# Altium project BiSheFinal.PrjPcb
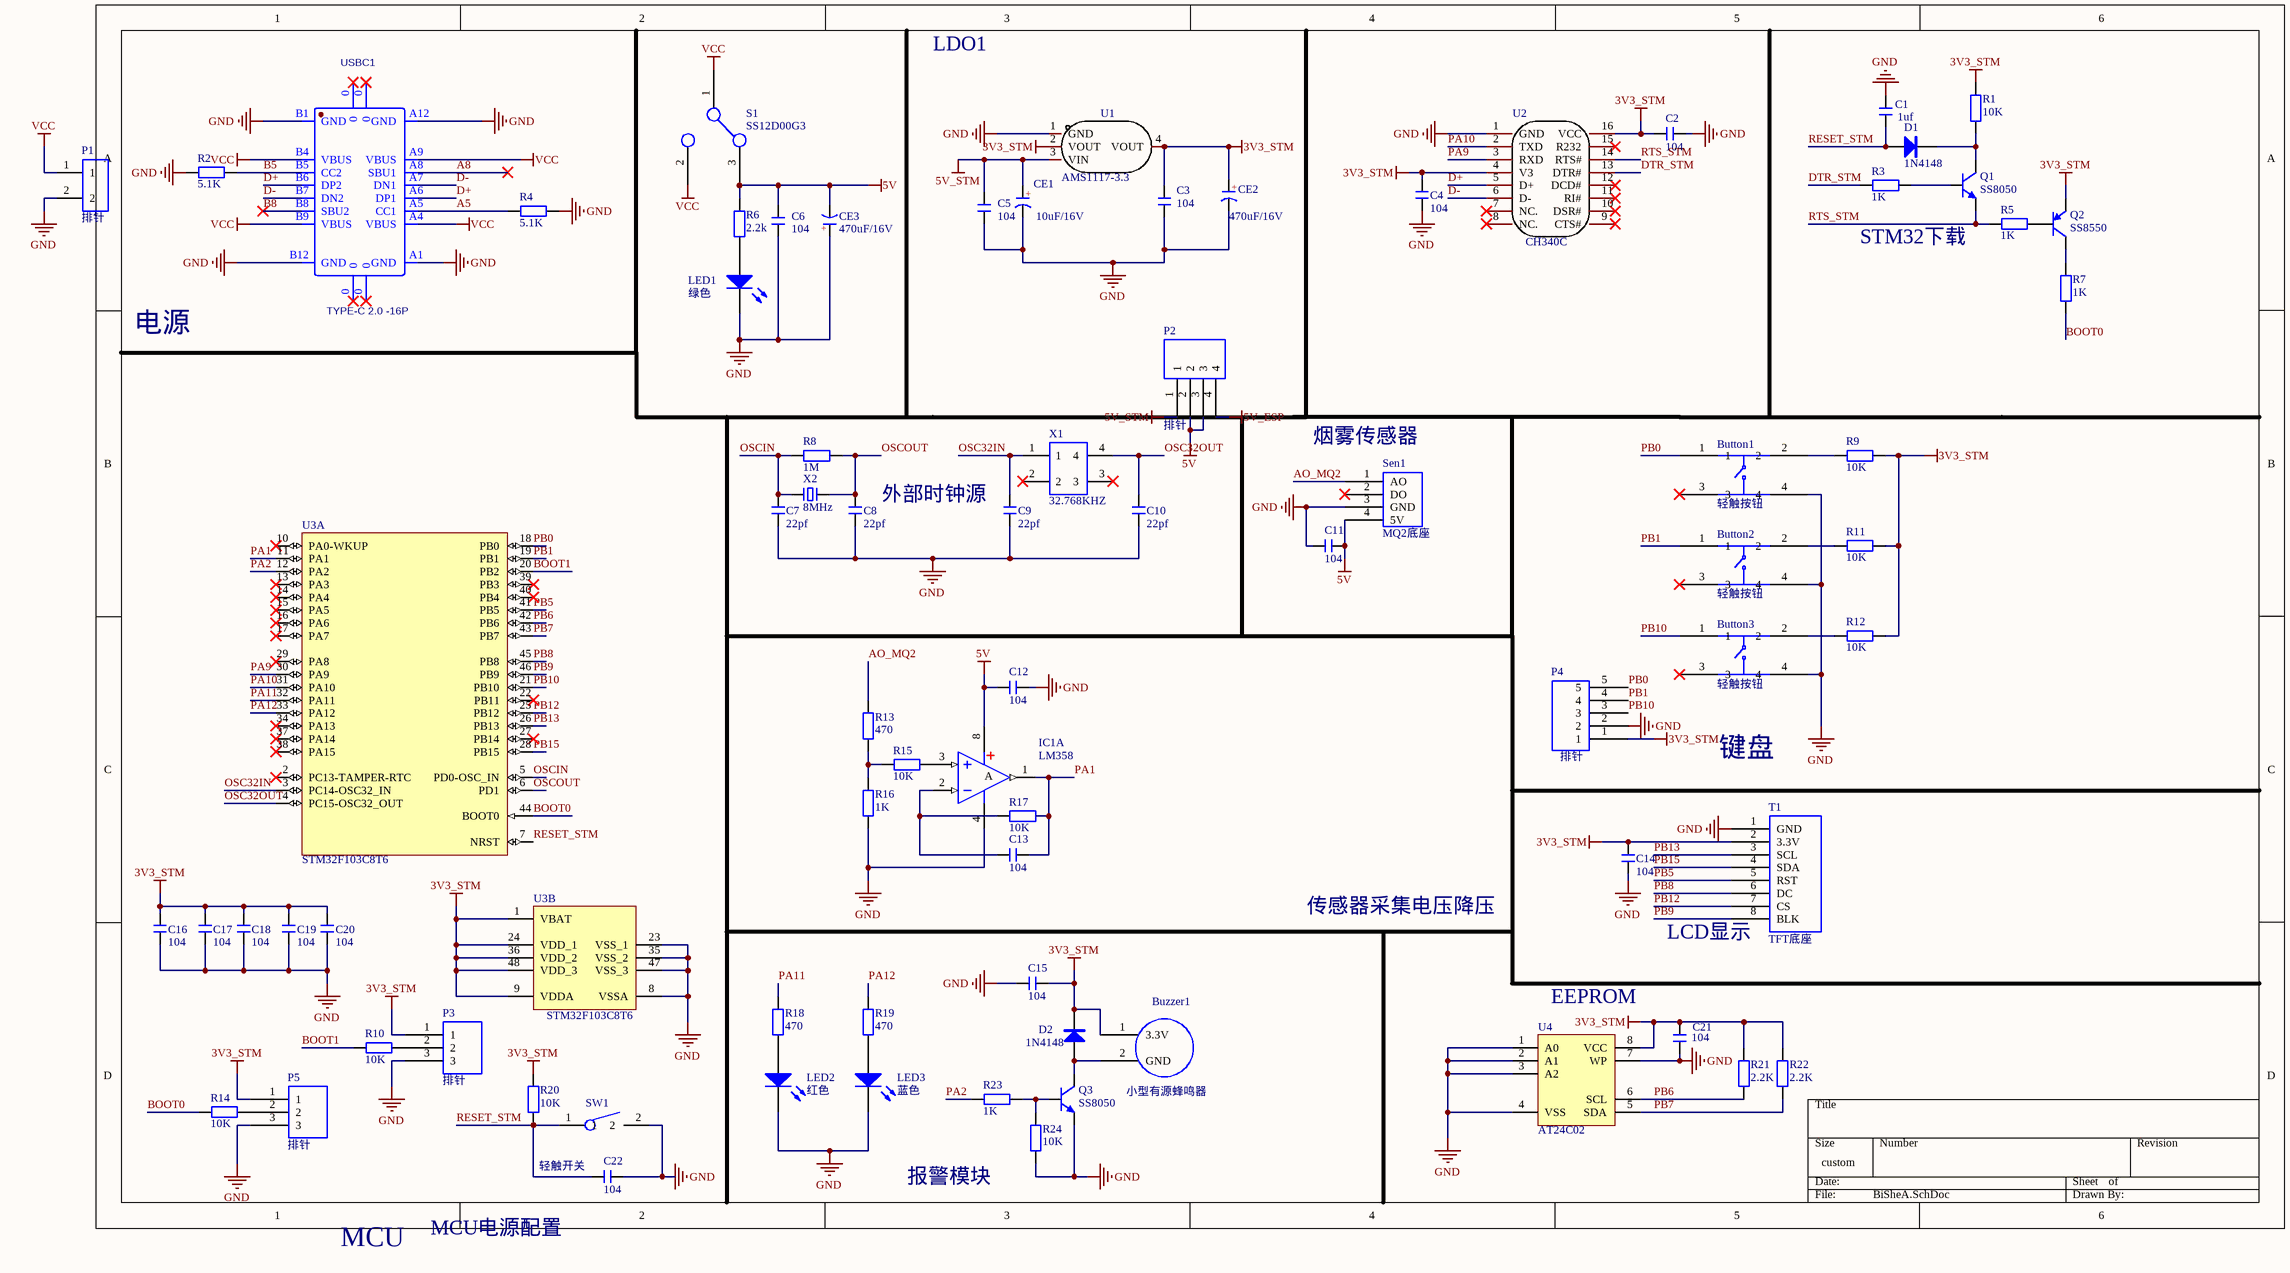
[diagram p0: BiSheA.SchDoc]
2 sheets, 102 parts. Net scope: global (net labels, ports and power ports of the same name join across sheets).
Board file: BiShe.PcbDoc
Sheets:
  BiSheA.SchDoc
  BiSheB.SchDoc

## Sheet BiSheA.SchDoc
size 431 x 241 mm; SheetNumber: 1; SheetTotal: 2

### Parts
Button1  轻触按钮  [Button]
Button2  轻触按钮  [Button]
Button3  轻触按钮  [Button]
Buzzer1  小型有源蜂鸣器  [Buzzer_Mini]
C1  1uf  [C 0805_L]
C2  104  [C 0805_L]
C3  104  [C 0805_L]
C4  104  [C 0805_L]
C5  104  [C 0805_L]
C6  104  [C 0805_L]
C7  22pf  [C 0805_L]
C8  22pf  [C 0805_L]
C9  22pf  [C 0805_L]
C10  22pf  [C 0805_L]
C11  104  [C 0805_L]
C12  104  [C 0805_L]
C13  104  [C 0805_L]
C14  104  [C 0805_L]
C15  104  [C 0805_L]
C16  104  [C 0805_L]
C17  104  [C 0805_L]
C18  104  [C 0805_L]
C19  104  [C 0805_L]
C20  104  [C 0805_L]
C21  104  [C 0805_L]
C22  104  [C 0805_L]
CE1  10uF/16V  [CAP 1.5*4*8]
CE2  470uF/16V  [CAP 3.5*8*11.5]
CE3  470uF/16V  [CAP 3.5*8*11.5]
D1  1N4148  [SOD-123]
D2  1N4148  [SOD-123]
IC1  LM358  [SOP8_N]  (part A of 2)
LED1  绿色  [LED 5MM-B]
LED2  红色  [LED 5MM-B]
LED3  蓝色  [LED 5MM-B]
P1  排针  [2PIN]
P2  排针  [4PIN]
P3  排针  [3Pin]
P4  排针  [5pin]
P5  排针  [3Pin]
Q1  SS8050  [SOT23-3N]
Q2  SS8550  [SOT23-3N]
Q3  SS8050  [SOT23-3N]
R1  10K  [R 0805_L]
R2  5.1K  [R 0805_L]
R3  1K  [R 0805_L]
R4  5.1K  [R 0805_L]
R5  1K  [R 0805_L]
R6  2.2k  [R 0805_L]
R7  1K  [R 0805_L]
R8  1M  [R 0805_L]
R9  10K  [R 0805_L]
R10  10K  [R 0805_L]
R11  10K  [R 0805_L]
R12  10K  [R 0805_L]
R13  470  [R 0805_L]
R14  10K  [R 0805_L]
R15  10K  [R 0805_L]
R16  1K  [R 0805_L]
R17  10K  [R 0805_L]
R18  470  [R 0805_L]
R19  470  [R 0805_L]
R20  10K  [R 0805_L]
R21  2.2K  [R 0805_L]
R22  2.2K  [R 0805_L]
R23  1K  [R 0805_L]
R24  10K  [R 0805_L]
S1  SS12D00G3  [SS12D00G3]
Sen1  MQ2底座  [MQ2底座]
SW1  轻触开关  [SW1P]
T1  TFT底座  [TFT底座]
U1  AMS1117-3.3  [SOT-223-3_L6.5-W3.4-P2.30-LS7.0-BR]
U2  CH340C  [SOP-16_L10.0-W3.9-P1.27-LS6.0-BL]
U3  STM32F103C8T6  [LQFP48_N]  (parts A,B of 2)
U4  AT24C02  [SOIC8_N]
USBC1  TYPE-C 2.0 -16P  [USB-C-SMD_TYPE-C-USB-5]
X1  32.768KHZ  [MC-306]
X2  8MHz  [OSC HC-49S]

### Nets
3V3_STM: Buzzer1.1(3.3V) C2.1 C3.2 C4.2 C14.2 C15.2 C16.1 C17.1 C18.1 C19.1 C20.1 C21.2 CE2.1(A) D2.2(K) P3.1 P4.1 P5.1 Q2.2(E) R1.1 R9.1 R11.1 R12.1 R20.1 R21.1 R22.1 T1.2(3.3V) U1.2(VOUT) U1.4(VOUT) U2.4(V3) U2.16(VCC) U3.1(VBAT) U3.9(VDDA) U3.24(VDD_1) U3.36(VDD_2) U3.48(VDD_3) U4.8(VCC)
5V: C6.2 C11.2 C12.2 CE3.2(K) IC1.8(V+) P2.2 P2.3 R6.1 S1.3 Sen1.4(5V)
5V_ESP: P2.4
5V_STM: C5.2 CE1.1(A) P2.1 U1.3(VIN)
GND: Button1.4 Button2.4 Button3.4 C1.1 C2.2 C3.1 C4.1 C5.1 C6.1 C7.2 C8.2 C9.2 C10.2 C11.1 C12.1 C14.1 C15.1 C16.2 C17.2 C18.2 C19.2 C20.2 C21.1 C22.2 CE1.2(K) CE2.2(K) CE3.1(A) IC1.4(V-) LED1.2(K) LED2.2(K) LED3.2(K) P1.2 P3.3 P4.2 P5.3 Q3.2(E) R2.2 R4.1 R16.2 R24.2 Sen1.3(GND) SW1.2 T1.1(GND) U1.1(GND) U2.1(GND) U3.8(VSSA) U3.23(VSS_1) U3.35(VSS_2) U3.47(VSS_3) U4.1(A0) U4.2(A1) U4.3(A2) U4.4(VSS) U4.7(WP) USBC1.A1(GND) USBC1.A12(GND) USBC1.B1(GND) USBC1.B12(GND)
VCC: P1.1 S1.1 S1.2 USBC1.A4(VBUS) USBC1.A9(VBUS) USBC1.B4(VBUS) USBC1.B9(VBUS)
A5: R4.2 USBC1.A5(CC1)
A8: USBC1.A8(SBU1)
AO_MQ2: R13.1 Sen1.1(AO)
B5: R2.1 USBC1.B5(CC2)
B8: USBC1.B8(SBU2)
BOOT0: R7.2 R14.2 U3.44(BOOT0)
BOOT1: R10.2 U3.20(PB2)
D+: U2.5(D+) USBC1.A6(DP1) USBC1.B6(DP2)
D-: U2.6(D-) USBC1.A7(DN1) USBC1.B7(DN2)
DTR_STM: R3.1 U2.13(DTR#)
OSC32IN: C9.1 U3.3(PC14-OSC32_IN) X1.1
OSC32OUT: C10.1 U3.4(PC15-OSC32_OUT) X1.4
OSCIN: C7.1 R8.2 U3.5(PD0-OSC_IN) X2.1
OSCOUT: C8.1 R8.1 U3.6(PD1) X2.2
PA1: C13.1 IC1.1(OUT) R17.1 U3.11(PA1)
PA2: R23.1 U3.12(PA2)
PA9: U2.3(RXD) U3.30(PA9)
PA10: U2.2(TXD) U3.31(PA10)
PA11: R18.1 U3.32(PA11)
PA12: R19.1 U3.33(PA12)
PB0: Button1.1 P4.5 U3.18(PB0)
PB1: Button2.1 P4.4 U3.19(PB1)
PB5: T1.5(RST) U3.41(PB5)
PB6: R21.2 U3.42(PB6) U4.6(SCL)
PB7: R22.2 U3.43(PB7) U4.5(SDA)
PB8: T1.6(DC) U3.45(PB8)
PB9: T1.8(BLK) U3.46(PB9)
PB10: Button3.1 P4.3 U3.21(PB10)
PB12: T1.7(CS) U3.25(PB12)
PB13: T1.3(SCL) U3.26(PB13)
PB15: T1.4(SDA) U3.28(PB15)
RESET_STM: C1.2 C22.1 D1.1(A) R20.2 SW1.1 U3.7(NRST)
RTS_STM: Q1.2(E) R5.1 U2.14(RTS#)
NetButton1_2: Button1.2 R9.2
NetButton2_2: Button2.2 R11.2
NetButton3_2: Button3.2 R12.2
NetBuzzer1_2: Buzzer1.2(GND) D2.1(A) Q3.3(C)
NetC13_2: C13.2 IC1.2(IN-) R17.2
NetD1_2: D1.2(K) Q1.3(C) R1.2
NetIC1_3: IC1.3(IN+) R15.1
NetLED1_1: LED1.1(A) R6.2
NetLED2_1: LED2.1(A) R18.2
NetLED3_1: LED3.1(A) R19.2
NetP3_2: P3.2 R10.1
NetP5_2: P5.2 R14.1
NetQ1_1: Q1.1(B) R3.2
NetQ2_1: Q2.1(B) R5.2
NetQ2_3: Q2.3(C) R7.1
NetQ3_1: Q3.1(B) R23.2 R24.1
NetR13_2: R13.2 R15.2 R16.1

Not connected (* = marked no-connect by the designer): Button1 3*; Button2 3*; Button3 3*; Sen1 2(DO)*; U2 7(NC.)* 8(NC.)* 9(CTS#)* 10(DSR#)* 11(RI#)* 12(DCD#)* 15(R232)*; U3 2(PC13-TAMPER-RTC)* 10(PA0-WKUP)* 13(PA3)* 14(PA4)* 15(PA5)* 16(PA6)* 17(PA7)* 22(PB11)* 27(PB14)* 29(PA8)* 34(PA13)* 37(PA14)* 38(PA15)* 39(PB3)* 40(PB4)*; USBC1 0*; X1 2* 3*

### Notes on the sheet
- LDO1
- STM32下载
- 电源
- (near Sen1) 烟雾传感器
- (near C8) 外部时钟源
- 键盘
- 传感器采集电压降压
- LCD显示
- (near U4) EEPROM
- 报警模块
- MCU
- MCU电源配置
- (in symbol CE) +
- (in symbol LM358, part A) A

### Library data of the parts
Button1-Button3 = Button: 6*6*7轻触按钮
Buzzer1 = Buzzer: 蜂鸣器
C1-C22 = C: 贴片电容; BOM名称: 无极性贴片电容; 淘宝ID: 封装库来自淘宝 ID：黄晶宝石; 联系售后，技术支持: https://shop463601444.taobao.com; 唯一出售店铺网址: https://shop463601444.taobao.com
CE1-CE3 = CE: 直插电解电容; 淘宝ID: 封装库来自淘宝 ID：黄晶宝石; BOM名称: 直插电解电容; 联系售后: https://item.taobao.com/item.htm?id=566775463719
D1 D2 = 1N4148: 开关二极管; BOM名称: 高速开关二极管; 淘宝ID: 封装库来自淘宝 ID：黄晶宝石
IC1 = LM358: 双路运放; 学习资源: 最新版本发布https://item.taobao.com/item.htm?id=566775463719; BOM名称: 双路运放
LED1-LED3 = LED-5MM: 直插5mm LED; BOM名称: 5mm插件LED; 版权归属: 封装库来自淘宝 ID：黄晶宝石; 学习资源: https://item.taobao.com/item.htm?id=566775463719
P1 = 2Pin: 2Pin排针
P2 = 4Pin: 4p排针
P3 P5 = 3Pin: 3p排针
P4 = 5Pin: 5Pin排针
Q1 Q3 = 8050-SMD: 高频放大-NPN型; 联系售后: 最新版本发布https://item.taobao.com/item.htm?id=566775463719; 版权归属: 封装库来自淘宝 ID：黄晶宝石; 属性: 40V 1.5A 1W 100MHZ; BOM名称: 高频放大-NPN型
Q2 = 8550-SMD: 高频放大-PNP型; 学习资源: 最新版本发布https://item.taobao.com/item.htm?id=566775463719; 版权归属: 封装库来自淘宝 ID：黄晶宝石; 属性: 40V 1.5A 1W 100MHZ; BOM名称: 高频放大-PNP型
R1-R24 = R: 贴片电阻; 版权归属: 来自淘宝 ID：黄晶宝石; 封装库来自淘宝卖家 ID：黄晶宝石: 其他店铺购入均为盗版，不享受售后技术支持服务，请立即申请退款; BOM名称: 贴片电阻; 联系售后: https://item.taobao.com/item.htm?id=566775463719
S1 = SS12D00G3: 拨动开关
Sen1 = MQ2底座: 气体传感器
SW1 = SW1P: 单刀单掷清除开关
T1 = TFT底座: 底座
U1 = AMS1117-3.3_C6186: 输出类型:固定;输出极性:正;最大输入电压:-;输出电压:3.3V;输出电流:1A;电源纹波抑制比(PSRR):72dB@(120Hz);; Manufacturer: AMS; Add into BOM: yes; Output Type: 固定; Output Polarity: 正; Number of Outputs: 1; Output Voltage: 3.3V; Dropout Voltage: 1.3V@(800mA); Output Current: 1A; Symbol: AMS1117-3.3; Device: AMS1117-3.3_C6186; LCSC Part Name: 正 Vout=3.3V 1A 72dB@(120Hz); Supplier Part: C6186; Manufacturer Part: AMS1117-3.3; Supplier Footprint: SOT-223; JLCPCB Part Class: Basic Part; Datasheet: https://atta.szlcsc.com/upload/public/pdf/source/20180727/C6186_7A095716F0823C02F1997A905E26C086.pdf; Supplier: LCSC; Convert to PCB: yes; Maximum Input Voltage: -; Quiescent Current (Ground Current): -; Power Supply Rejection Ratio (PSRR): 72dB@(120Hz); Noise: -; Feature: -; Operating Temperature: -; AMS1117: AMS1117-3.3
U2 = CH340C: 驱动器/接收器数:-;协议类别:USB 2.0;类型:Transceiver;数据速率:2Mbps;; Manufacturer: WCH(南京沁恒); Add into BOM: yes; Protocol: USB 2.0; Supply Voltage: 3.3V, 5V; Data Rate: 2Mbps; Symbol: CH340C; Device: CH340C; LCSC Part Name: CH340C; Supplier Part: C84681; Manufacturer Part: CH340C; Supplier Footprint: SOP-16_150mil; JLCPCB Part Class: Extended Part; Datasheet: https://atta.szlcsc.com/upload/public/pdf/source/20200819/C84681_ADBED554CE321879DBD6B1D06488689C.pdf; Supplier: LCSC; Convert to PCB: yes; Number of Drivers/Receivers: -; Type: Transceiver; CH340C: CH340C
U3 = STM32F103C8T6: STM32 ARM-based 32-bit MCU Performance Line with 64 kB Flash, 20 kB Internal RAM, -40 to +85癈 Temperature, 48-Pin LQFP, Tray; DatasheetVersion: rev13.0, Apr-2011; PackageVersion: rev13, Apr-2011; PackageReference: LQFP48; PackageDescription: 48-Pin Low-Profile Quad Flat Pack, 7 x 7 mm Body, 0.5 mm Pitch (LQFP48); ComponentLink1Description: Manufacturer URL; ComponentLink1URL: http://www.st.com/; ComponentLink2Description: STM32F103 Datasheet; ComponentLink2URL: http://www.st.com/internet/com/TECHNICAL_RESOURCES/TECHNICAL_LITERATURE/DATASHEET/CD00161566.pdf; ComponentLink3Description: STM32 Family Web Page; ComponentLink3URL: www.st.com/stm32; 联系售后: https://shop463601444.taobao.com
U4 = AT24C02: EEROM存储器
USBC1 = USB2.0 Type-C 16Pin母座: USB2.0 Type-C 母座 16Pin; BOM_Supplier: LCSC; BOM_Manufacturer Part: -; spiceSymbolName: TYPE-C 3.1 -16P_C168689
X1 = MC-306: 贴片32.768KHZ
X2 = XTAL-2P: 2脚无源脚晶振; 版权归属: 封装库来自淘宝卖家 ID：黄晶宝石; BOM名称: 2脚无源脚晶振; 学习资源: https://shop463601444.taobao.com

## Sheet BiSheB.SchDoc
size A4; SheetNumber: 2; SheetTotal: 2
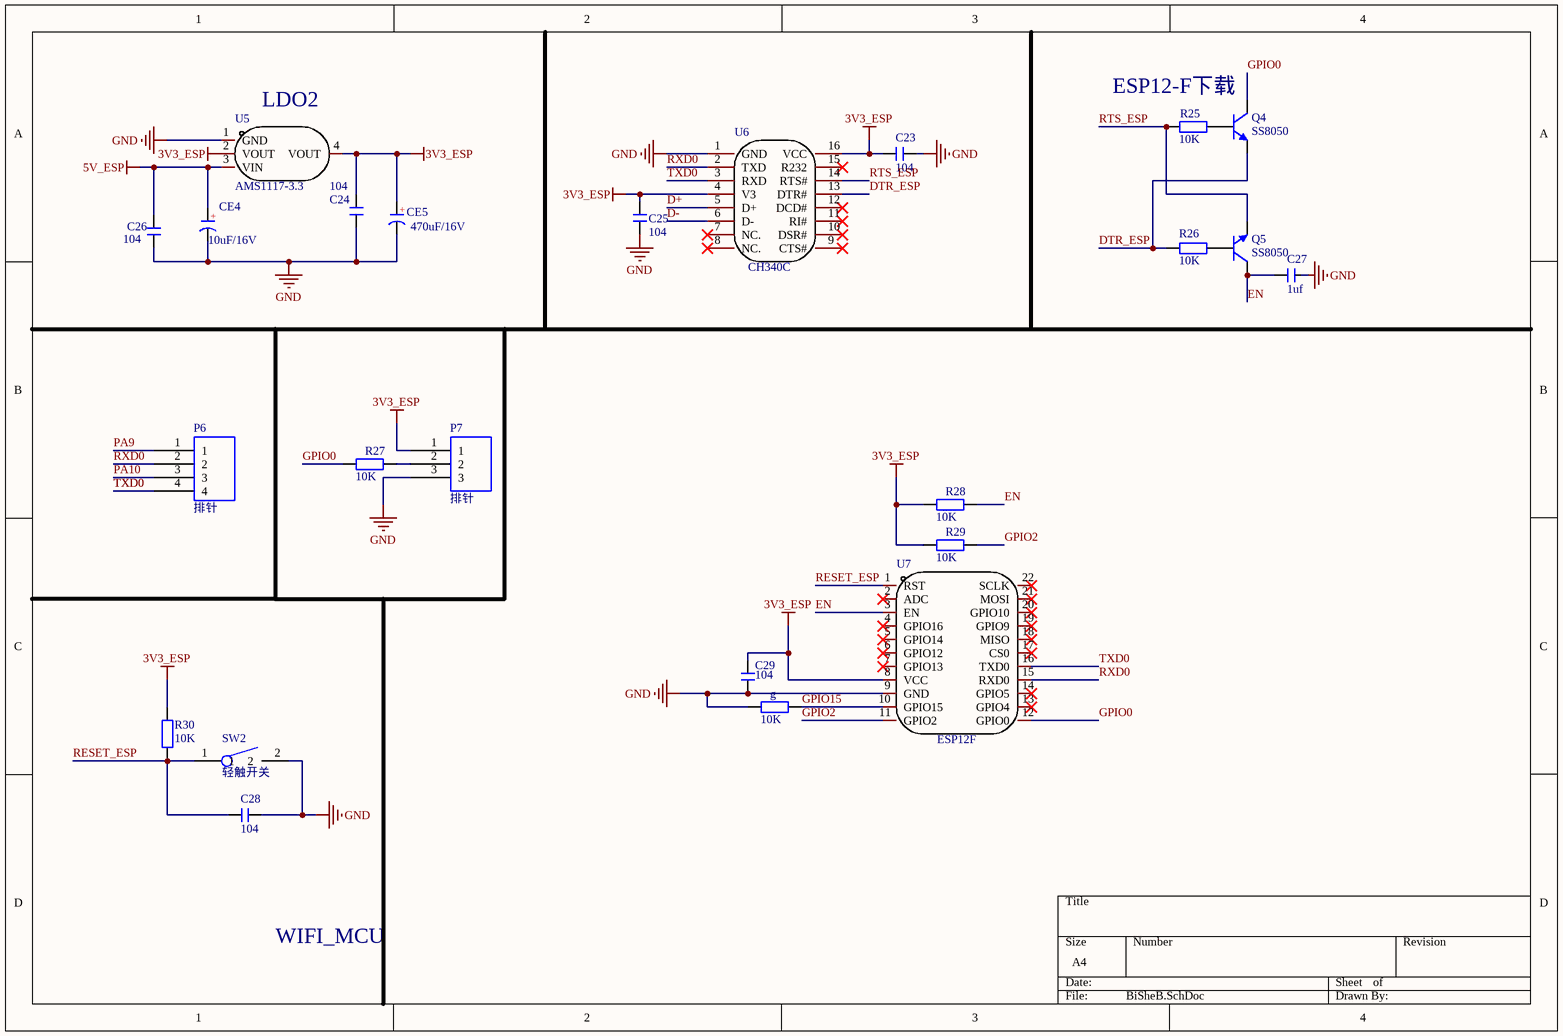
[diagram p1: BiSheB.SchDoc]

### Parts
C23  104  [C 0805_L]
C24  104  [C 0805_L]
C25  104  [C 0805_L]
C26  104  [C 0805_L]
C27  1uf  [C 0805_L]
C28  104  [C 0805_L]
C29  104  [C 0805_L]
CE4  10uF/16V  [CAP 1.5*4*8]
CE5  470uF/16V  [CAP 3.5*8*11.5]
g  10K  [R 0805_L]
P6  排针  [4PIN]
P7  排针  [3Pin]
Q4  SS8050  [SOT23-3N]
Q5  SS8050  [SOT23-3N]
R25  10K  [R 0805_L]
R26  10K  [R 0805_L]
R27  10K  [R 0805_L]
R28  10K  [R 0805_L]
R29  10K  [R 0805_L]
R30  10K  [R 0805_L]
SW2  轻触开关  [SW1P]
U5  AMS1117-3.3  [SOT-223-3_L6.5-W3.4-P2.30-LS7.0-BR]
U6  CH340C  [SOP-16_L10.0-W3.9-P1.27-LS6.0-BL]
U7  ESP12F  [WIFIM-SMD_ESP-12F-ESP8266MOD]

### Nets
3V3_ESP: C23.1 C24.2 C25.2 C29.1 CE5.1(A) P7.1 R28.1 R29.1 R30.1 U5.2(VOUT) U5.4(VOUT) U6.4(V3) U6.16(VCC) U7.8(VCC)
5V_ESP: C26.1 CE4.1(A) U5.3(VIN)
GND: C23.2 C24.1 C25.1 C26.2 C27.2 C28.2 C29.2 CE4.2(K) CE5.2(K) g.1 P7.3 SW2.2 U5.1(GND) U6.1(GND) U7.9(GND)
D+: U6.5(D+)
D-: U6.6(D-)
DTR_ESP: Q4.2(E) R26.2 U6.13(DTR#)
EN: C27.1 Q5.3(C) R28.2 U7.3(EN)
GPIO0: Q4.3(C) R27.1 U7.12(GPIO0)
GPIO2: R29.2 U7.11(GPIO2)
GPIO15: g.2 U7.10(GPIO15)
PA9: P6.1
PA10: P6.3
RESET_ESP: C28.1 R30.2 SW2.1 U7.1(RST)
RTS_ESP: Q5.2(E) R25.2 U6.14(RTS#)
RXD0: P6.2 U6.2(TXD) U7.15(RXD0)
TXD0: P6.4 U6.3(RXD) U7.16(TXD0)
NetP7_2: P7.2 R27.2
NetQ4_1: Q4.1(B) R25.1
NetQ5_1: Q5.1(B) R26.1

Not connected (* = marked no-connect by the designer): U6 7(NC.)* 8(NC.)* 9(CTS#)* 10(DSR#)* 11(RI#)* 12(DCD#)* 15(R232)*; U7 2(ADC)* 4(GPIO16)* 5(GPIO14)* 6(GPIO12)* 7(GPIO13)* 13(GPIO4)* 14(GPIO5)* 17(CS0)* 18(MISO)* 19(GPIO9)* 20(GPIO10)* 21(MOSI)* 22(SCLK)*

### Notes on the sheet
- (near U5) LDO2
- ESP12-F下载
- WIFI_MCU
- (in symbol CE) +

### Library data of the parts
C23-C29 = C: as C1 on sheet BiSheA; 联系售后，技术支持: https://shop463601444.taobao.com; 唯一出售店铺网址: https://shop463601444.taobao.com
CE4 CE5 = CE: 直插电解电容; 淘宝ID: 封装库来自淘宝 ID：黄晶宝石; BOM名称: 直插电解电容; 联系售后: https://item.taobao.com/item.htm?id=566775463719
g R25-R30 = R: as R1 on sheet BiSheA; BOM名称: 贴片电阻; 联系售后: https://item.taobao.com/item.htm?id=566775463719
P6 = 4Pin: 4p排针
P7 = 3Pin: 3p排针
Q4 Q5 = 8050-SMD: as Q1 on sheet BiSheA; BOM名称: 高频放大-NPN型
SW2 = SW1P: 单刀单掷清除开关
U5 = AMS1117-3.3_C6186: as U1 on sheet BiSheA; Symbol: AMS1117-3.3; Device: AMS1117-3.3_C6186; LCSC Part Name: 正 Vout=3.3V 1A 72dB@(120Hz); Supplier Part: C6186; Manufacturer Part: AMS1117-3.3; Supplier Footprint: SOT-223; JLCPCB Part Class: Basic Part; Datasheet: https://atta.szlcsc.com/upload/public/pdf/source/20180727/C6186_7A095716F0823C02F1997A905E26C086.pdf; Supplier: LCSC; Convert to PCB: yes; Maximum Input Voltage: -; Quiescent Current (Ground Current): -; Power Supply Rejection Ratio (PSRR): 72dB@(120Hz); Noise: -; Feature: -; Operating Temperature: -; AMS1117: AMS1117-3.3
U6 = CH340C: as U2 on sheet BiSheA; Symbol: CH340C; Device: CH340C; LCSC Part Name: CH340C; Supplier Part: C84681; Manufacturer Part: CH340C; Supplier Footprint: SOP-16_150mil; JLCPCB Part Class: Extended Part; Datasheet: https://atta.szlcsc.com/upload/public/pdf/source/20200819/C84681_ADBED554CE321879DBD6B1D06488689C.pdf; Supplier: LCSC; Convert to PCB: yes; Number of Drivers/Receivers: -; Type: Transceiver; CH340C: CH340C
U7 = ESP-12F(ESP8266MOD): 频率:2.4GHz;发射功率:16dBm;核心处理器:ESP8266;天线形式:PCB 板载天线;接收灵敏度:-90dBm;; Manufacturer: Ai-Thinker(安信可); Add into BOM: yes; Value: 2.4GHz; Output Power: 16dBm; Support Interface: GPIO；UART；I2C；PWM；SPI；ADC; Wireless Standard: 802.11b/g/n; Operating Voltage: 3.3V; Receive  Current: 120mA; Send  Current: 170mA; Sensitivity: -90dBm; Symbol: ESP-12F(ESP8266MOD); Device: ESP-12F(ESP8266MOD); LCSC Part Name: ESP-12F(ESP8266MOD); Supplier Part: C82891; Manufacturer Part: ESP-12F(ESP8266MOD); Supplier Footprint: SMD,16x24mm; JLCPCB Part Class: Extended Part; Datasheet: https://atta.szlcsc.com/upload/public/pdf/source/20210219/C82891_ABD84A460F4F056A2757267CCCA4B508.pdf; Supplier: LCSC; Convert to PCB: yes; Core Processor: ESP8266; Antenna Type: PCB 板载天线; Operating Temperature: -40℃~+85℃; ESP: ESP12F

## Nets that join several sheets
5V_ESP: BiSheA (P2.4), BiSheB (C26.1 CE4.1 U5.3)
GND: BiSheA (58 pins), BiSheB (15 pins)
D+: BiSheA (U2.5 USBC1.A6 USBC1.B6), BiSheB (U6.5)
D-: BiSheA (U2.6 USBC1.A7 USBC1.B7), BiSheB (U6.6)
PA9: BiSheA (U2.3 U3.30), BiSheB (P6.1)
PA10: BiSheA (U2.2 U3.31), BiSheB (P6.3)